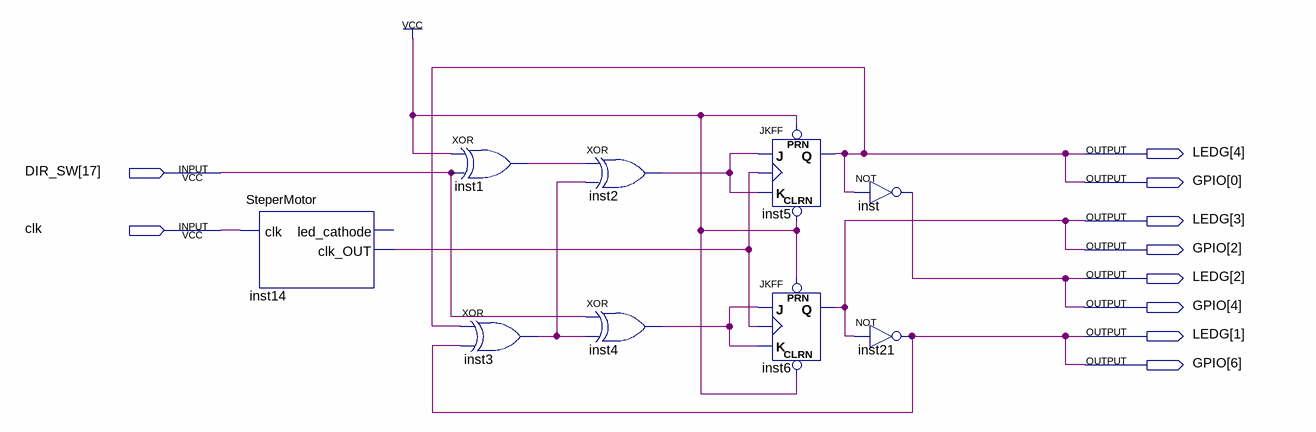
[diagram p0: schematic sheet]
// Quartus schematic StepperMotor.bdf as structural Verilog: 9 symbols, 10 pins
module StepperMotor (
  input  [17:17] DIR_SW,
  input  clk,
  output [4:1] LEDG,
  output [6:0] GPIO
);

  wire inst1_out, inst2_out, inst3_out, inst4_out, inst14_clk_out;

  SteperMotor inst14 (.clk(clk), .clk_OUT(inst14_clk_out));  // open: led_cathode
  xor inst1 (inst1_out, 1'b1, DIR_SW[17]);
  xor inst3 (inst3_out, GPIO[0], GPIO[6]);
  xor inst2 (inst2_out, inst1_out, inst3_out);
  xor inst4 (inst4_out, DIR_SW[17], inst3_out);
  JKFF inst5 (.PRN(1'b1), .CLRN(1'b1), .K(inst2_out), .J(inst2_out), .CLK(inst14_clk_out), .Q(GPIO[0]));
  JKFF inst6 (.PRN(1'b1), .CLRN(1'b1), .K(inst4_out), .J(inst4_out), .CLK(inst14_clk_out), .Q(GPIO[2]));
  not inst (GPIO[4], GPIO[0]);
  not inst21 (GPIO[6], GPIO[2]);

  assign LEDG = {GPIO[0], GPIO[2], GPIO[4], GPIO[6]};
endmodule
